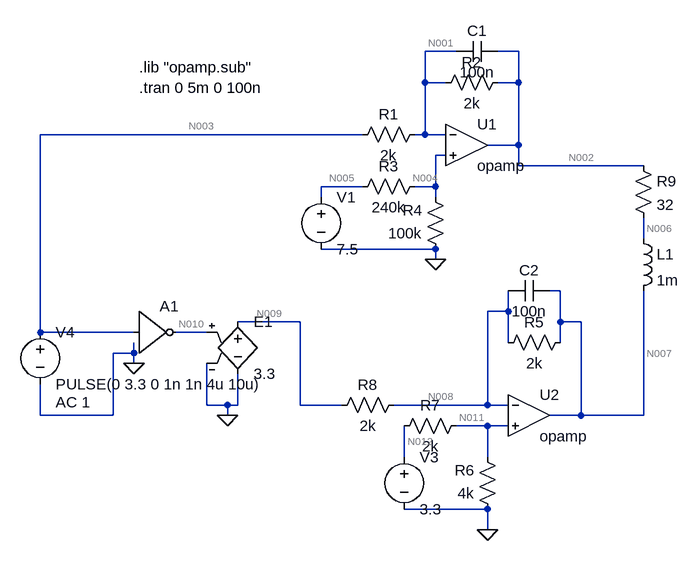
[diagram p0: schematic 3V3 100mA current drive sim.asc]
3V3 100mA current drive sim.asc, the LTspice schematic file:
Version 4
SHEET 1 880 756
WIRE 208 0 160 0
WIRE 304 0 272 0
WIRE 160 48 160 0
WIRE 192 48 160 48
WIRE 304 48 304 0
WIRE 304 48 272 48
WIRE 64 128 -432 128
WIRE 160 128 160 48
WIRE 160 128 144 128
WIRE 192 128 160 128
WIRE 304 144 304 48
WIRE 304 144 256 144
WIRE 192 160 176 160
WIRE 304 176 304 144
WIRE 496 176 304 176
WIRE 64 208 0 208
WIRE 176 208 176 160
WIRE 176 208 144 208
WIRE 0 224 0 208
WIRE 176 224 176 208
WIRE 496 288 496 256
WIRE 176 304 0 304
WIRE 176 320 176 304
WIRE 368 368 352 368
WIRE 288 400 288 368
WIRE 288 400 256 400
WIRE -32 416 -128 416
WIRE 368 416 368 368
WIRE 400 416 368 416
WIRE -432 432 -432 128
WIRE -288 432 -432 432
WIRE -176 432 -224 432
WIRE 288 448 288 400
WIRE 368 448 368 416
WIRE -288 464 -288 448
WIRE -288 464 -320 464
WIRE -288 480 -288 464
WIRE -176 544 -176 480
WIRE -144 544 -176 544
WIRE -128 544 -128 496
WIRE -128 544 -144 544
WIRE -32 544 -32 416
WIRE 32 544 -32 544
WIRE 256 544 256 400
WIRE 256 544 112 544
WIRE 288 544 256 544
WIRE -432 560 -432 512
WIRE -320 560 -320 464
WIRE -320 560 -432 560
WIRE -144 560 -144 544
WIRE 400 560 400 416
WIRE 400 560 352 560
WIRE 496 560 496 368
WIRE 496 560 400 560
WIRE 256 576 208 576
WIRE 288 576 256 576
WIRE 128 624 128 576
WIRE 256 624 256 576
WIRE 256 704 128 704
WIRE 256 736 256 704
FLAG 176 320 0
FLAG 256 736 0
FLAG -288 480 0
FLAG -144 560 0
SYMBOL Opamps\\opamp 224 80 R0
SYMATTR InstName U1
SYMATTR SpiceLine2 GBW=500k
SYMBOL res 160 112 R90
WINDOW 0 0 56 VBottom 2
WINDOW 3 32 56 VTop 2
SYMATTR InstName R1
SYMATTR Value 2k
SYMBOL res 288 32 R90
WINDOW 0 0 56 VBottom 2
WINDOW 3 32 56 VTop 2
SYMATTR InstName R2
SYMATTR Value 2k
SYMBOL res 160 192 R90
WINDOW 0 0 56 VBottom 2
WINDOW 3 32 56 VTop 2
SYMATTR InstName R3
SYMATTR Value 240k
SYMBOL res 192 320 R180
WINDOW 0 36 76 Left 2
WINDOW 3 36 40 Left 2
SYMATTR InstName R4
SYMATTR Value 100k
SYMBOL voltage 0 208 R0
WINDOW 123 0 0 Left 2
WINDOW 39 0 0 Left 2
SYMATTR InstName V1
SYMATTR Value 7.5
SYMBOL cap 272 -16 R90
WINDOW 0 0 32 VBottom 2
WINDOW 3 32 32 VTop 2
SYMATTR InstName C1
SYMATTR Value 100n
SYMBOL Opamps\\opamp 320 496 R0
SYMATTR InstName U2
SYMATTR SpiceLine2 GBW=500k
SYMBOL res 384 432 R90
WINDOW 0 0 56 VBottom 2
WINDOW 3 32 56 VTop 2
SYMATTR InstName R5
SYMATTR Value 2k
SYMBOL cap 352 352 R90
WINDOW 0 0 32 VBottom 2
WINDOW 3 32 32 VTop 2
SYMATTR InstName C2
SYMATTR Value 100n
SYMBOL res 272 720 R180
WINDOW 0 36 76 Left 2
WINDOW 3 36 40 Left 2
SYMATTR InstName R6
SYMATTR Value 4k
SYMBOL res 112 592 R270
WINDOW 0 32 56 VTop 2
WINDOW 3 0 56 VBottom 2
SYMATTR InstName R7
SYMATTR Value 2k
SYMBOL res 16 560 R270
WINDOW 0 32 56 VTop 2
WINDOW 3 0 56 VBottom 2
SYMATTR InstName R8
SYMATTR Value 2k
SYMBOL voltage 128 608 R0
WINDOW 123 0 0 Left 2
WINDOW 39 0 0 Left 2
SYMATTR InstName V3
SYMATTR Value 3.3
SYMBOL voltage -432 416 R0
WINDOW 123 24 124 Left 2
WINDOW 39 0 0 Left 2
SYMATTR Value2 AC 1
SYMATTR InstName V4
SYMATTR Value PULSE(0 3.3 0 1n 1n 4u 10u)
SYMBOL res 480 160 R0
SYMATTR InstName R9
SYMATTR Value 32
SYMBOL ind 480 272 R0
SYMATTR InstName L1
SYMATTR Value 1m
SYMBOL Digital\\inv -288 368 R0
SYMATTR InstName A1
SYMBOL e -128 400 R0
SYMATTR InstName E1
SYMATTR Value 3.3
TEXT -280 24 Left 2 !.lib "opamp.sub"
TEXT -280 56 Left 2 !.tran 0 5m 0 100n

The netlist it stands for:
* 3V3 100mA current drive sim.asc
XU1 N001 N004 N002 opamp Aol=100K GBW=500k  ; pins invin noninvin out
R1 N001 N003 2k
R2 N002 N001 2k
R3 N004 N005 240k
R4 0 N004 100k
V1 N005 0 7.5
C1 N002 N001 100n
XU2 N008 N011 N007 opamp Aol=100K GBW=500k  ; pins invin noninvin out
R5 N007 N008 2k
C2 N007 N008 100n
R6 0 N011 4k
R7 N012 N011 2k
R8 N009 N008 2k
V3 N012 0 3.3
V4 N003 0 PULSE(0 3.3 0 1n 1n 4u 10u) AC 1
R9 N002 N006 32
L1 N006 N007 1m
A1 N003 0 0 0 0 N010 0 0 BUF
E1 N009 0 N010 0 3.3
.lib "opamp.sub"
.tran 0 5m 0 100n
.backanno
.end

* Results of the author's LTspice run, read from the files saved beside the schematic
* Operating Point, zero values left out:
*   V(n002) = 4.412 V
*   V(n004) = 2.206 V
*   V(n001) = 2.206 V
*   V(n005) = 7.5 V
*   V(n007) = 1.1 V
*   V(n011) = 2.2 V
*   V(n008) = 2.2 V
*   V(n012) = 3.3 V
*   V(n009) = 3.3 V
*   V(n006) = 1.1 V
*   V(n010) = 1 V
*   I(L1) = 103.5 mA
*   I(R9) = 103.5 mA
*   I(R8) = 550 µA
*   I(R7) = 550 µA
*   I(R6) = -550 µA
*   I(R5) = -550 µA
*   I(R4) = -22.06 µA
*   I(R3) = -22.06 µA
*   I(R2) = 1.103 mA
*   I(R1) = 1.103 mA
*   I(E1) = -550 µA
*   I(V4) = 1.103 mA
*   I(V3) = -550 µA
*   I(V1) = -22.06 µA
*   Ix(u1:3) = -104.6 mA
*   Ix(u2:3) = 104 mA
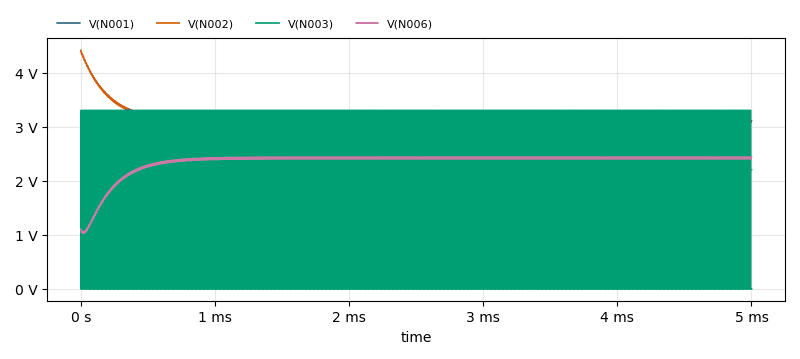
[diagram p1: Transient Analysis of 3V3 100mA current drive sim.asc, plotted from the saved traces]
* Transient Analysis, 1 run:
*   V(N001): min 2.203 V, max 2.211 V, average 2.206 V, rms 2.206 V, last 2.204 V
*   V(N002): min 3.074 V, max 4.412 V, average 3.144 V, rms 3.149 V, last 3.109 V
*   V(N003): min 0 V, max 3.3 V, average 1.32 V, rms 2.087 V, last 0 V
*   V(N006): min 1.024 V, max 2.438 V, average 2.352 V, rms 2.363 V, last 2.438 V